# EAGLE design Sensor QRD1114 (EAGLE 7.2.0)
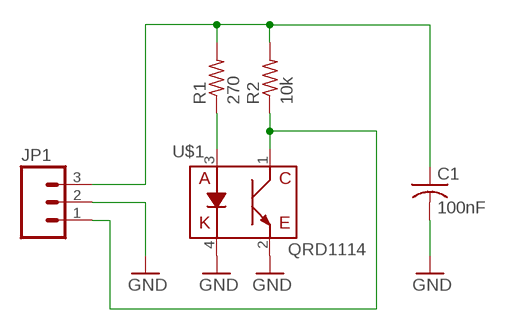
[diagram p0: schematic, sheet 1]

## Parts
C1  100nF  C-US025-024X044  [C025-024X044]
JP1  M03LOCK_LONGPADS  [1X03_LOCK_LONGPADS]
R1  270  R-US_0207/7  [0207/7]
R2  10k  R-US_0207/7  [0207/7]
U$1  QRD1114  [QRD1114]

## Nets
GND: C1.2 JP1.2 U$1.2(C) U$1.4(K)
N$1: R1.1 U$1.3(A)
N$4: JP1.1 R2.1 U$1.1(E)
N$5: C1.1 JP1.3 R1.2 R2.2

## Library data of the parts
C1 = resistor:C-US: CAPACITOR, American symbol
JP1 = SparkFun:M03: Header 3 Standard 3-pin 0.1" header. Use with straight break away headers (SKU : PRT-00116), right angle break away headers (PRT-00553), swiss pins (PRT-00743), machine pins (PRT-00117), and female headers (PRT-00115). Molex polarized connector foot print use with SKU : PRT-08232 with associated crimp pins and housings.
R1 R2 = resistor:R-US_: RESISTOR, American symbol
U$1 = SparkFun:QRD1114

## Board
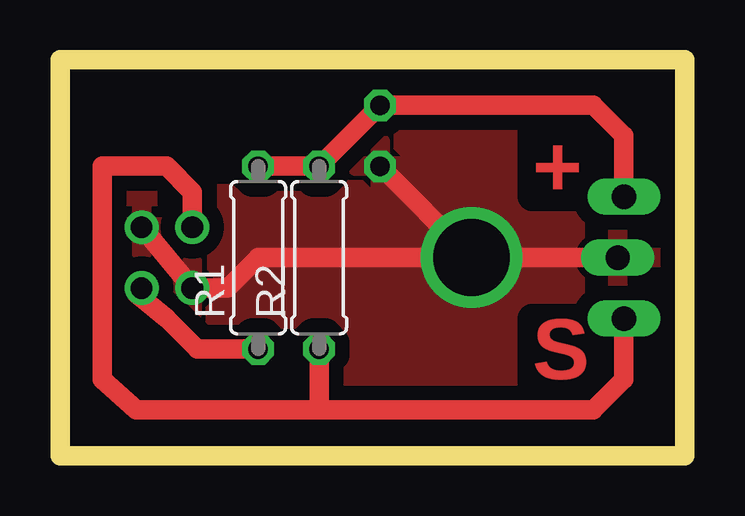
[diagram p1: board, top side]
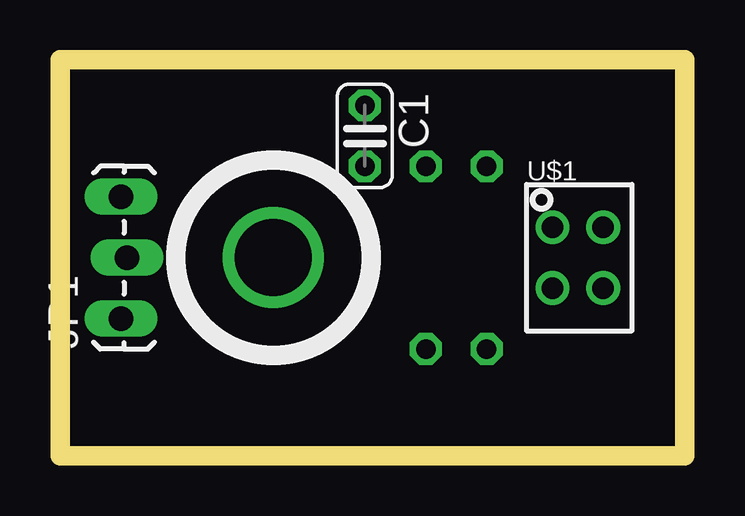
[diagram p2: board, bottom side, seen from below]

Size 26.04 x 16.5 mm. Coordinates in mm from the lower left corner, seen from the top.
Outline: 26.04,0 0,0 0,16.5 26.04,16.5 26.04,0
Copper layers (1*16): Top 0.035mm / dielectric 1.5mm / Bottom 0.035mm
Design rules "default": minimum track width 10mil, minimum drill 24mil, track to track 8mil, track to pad 8mil, pad to pad 8mil, via to via 8mil, smd to smd 8mil, copper to edge 40mil, drill to drill 8mil, minimum pad ring 10mil, minimum via ring 8mil, stop-mask expansion 4mil, vias tented up to drill 0mil, thermal gap 10mil
Milling: 4 lines

### Footprints (pad centres in the part's own frame; a part is rotated, then mirrored left to right if it is on the bottom)
C025-024X044 = drill 0.813 octagon: 1 -1.27,0; 2 1.27,0
1X03_LOCK_LONGPADS = drill 1.016 long: 1 0,0; 2 2.54,-0.254; 3 5.08,0
0207/7 = drill 0.813 octagon: 1 -3.81,0; 2 3.81,0
QRD1114 = drill 0.9 round: 1 -1.067,1.27; 2 -1.067,-1.27; 3 1.041,-1.27; 4 1.041,1.27

### Placement (x,y rotation side)
C1  13.34,13.34 270 bottom
JP1  23.5,5.71 90 bottom
R1  8.26,8.26 90 top
R2  10.79,8.26 90 top
U$1  4.45,8.26 0 bottom

### Tracks (layer width: path | path; a pad name or v marks a point on that pad's centre or on a via)
GND  (via drill 3.2)
  Top 0.813: U$1.4 U$1.2 6.99,6.99 8.26,8.26 v17.14,8.26 | v17.14,8.26 JP1.2 | v17.14,8.26 C1.2
  pour Top (isolate 0.61): 26.04,16.51 0,16.51 0,0 26.04,0
N$1
  Top 0.813: R1.1 5.71,4.45 4.45,5.71 3.17,6.76 U$1.3
N$4
  Top 0.813: U$1.1 5.51,11 4.45,12.06 1.75,12.06 1.75,3.17 3.17,1.91 10.79,1.91 | 10.79,1.91 R2.1 | JP1.1 23.5,3.17 22.23,1.91 10.79,1.91
N$5
  Top 0.813: R1.2 R2.2 C1.1 22.23,14.61 23.5,13.34 JP1.3

### Text on the board
Top: + | S